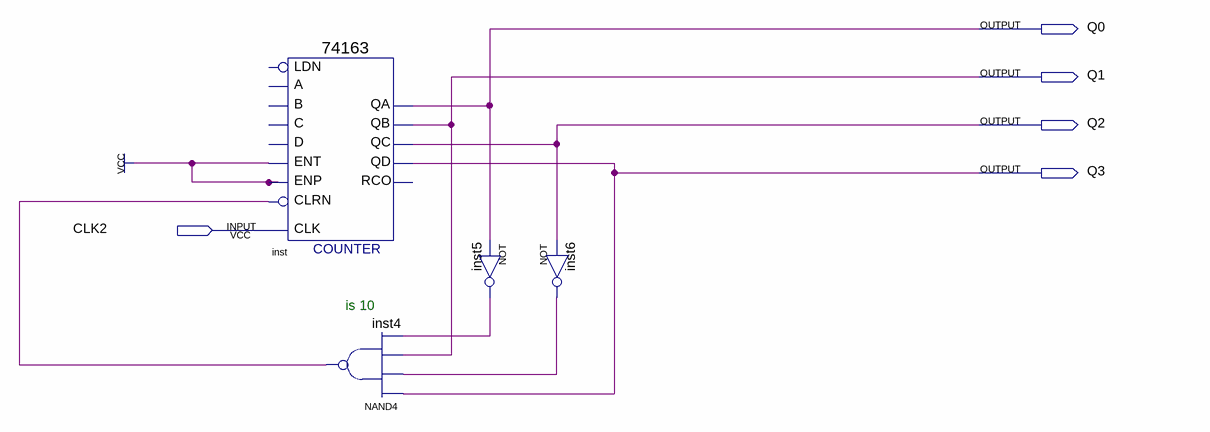
[diagram p0: schematic sheet]
// Quartus schematic lab2.bdf as structural Verilog: 4 symbols, 5 pins
module lab2 (
  input  CLK2,
  output Q0,
  output Q1,
  output Q2,
  output Q3
);

  wire inst4_out, inst5_out, inst6_out;

  \74163  inst (
    .ENT(1'b1), .CLRN(inst4_out), .CLK(CLK2), .ENP(1'b1), .QA(Q0), .QB(Q1), .QC(Q2), .QD(Q3));  // open: C, B, A, D, LDN, RCO
  nand inst4 (inst4_out, Q3, inst6_out, Q1, inst5_out);
  not inst5 (inst5_out, Q0);
  not inst6 (inst6_out, Q2);

  // Notes on the sheet:
  //   is 10
endmodule
